# EAGLE design onee_rev1 (EAGLE 7.2.0)
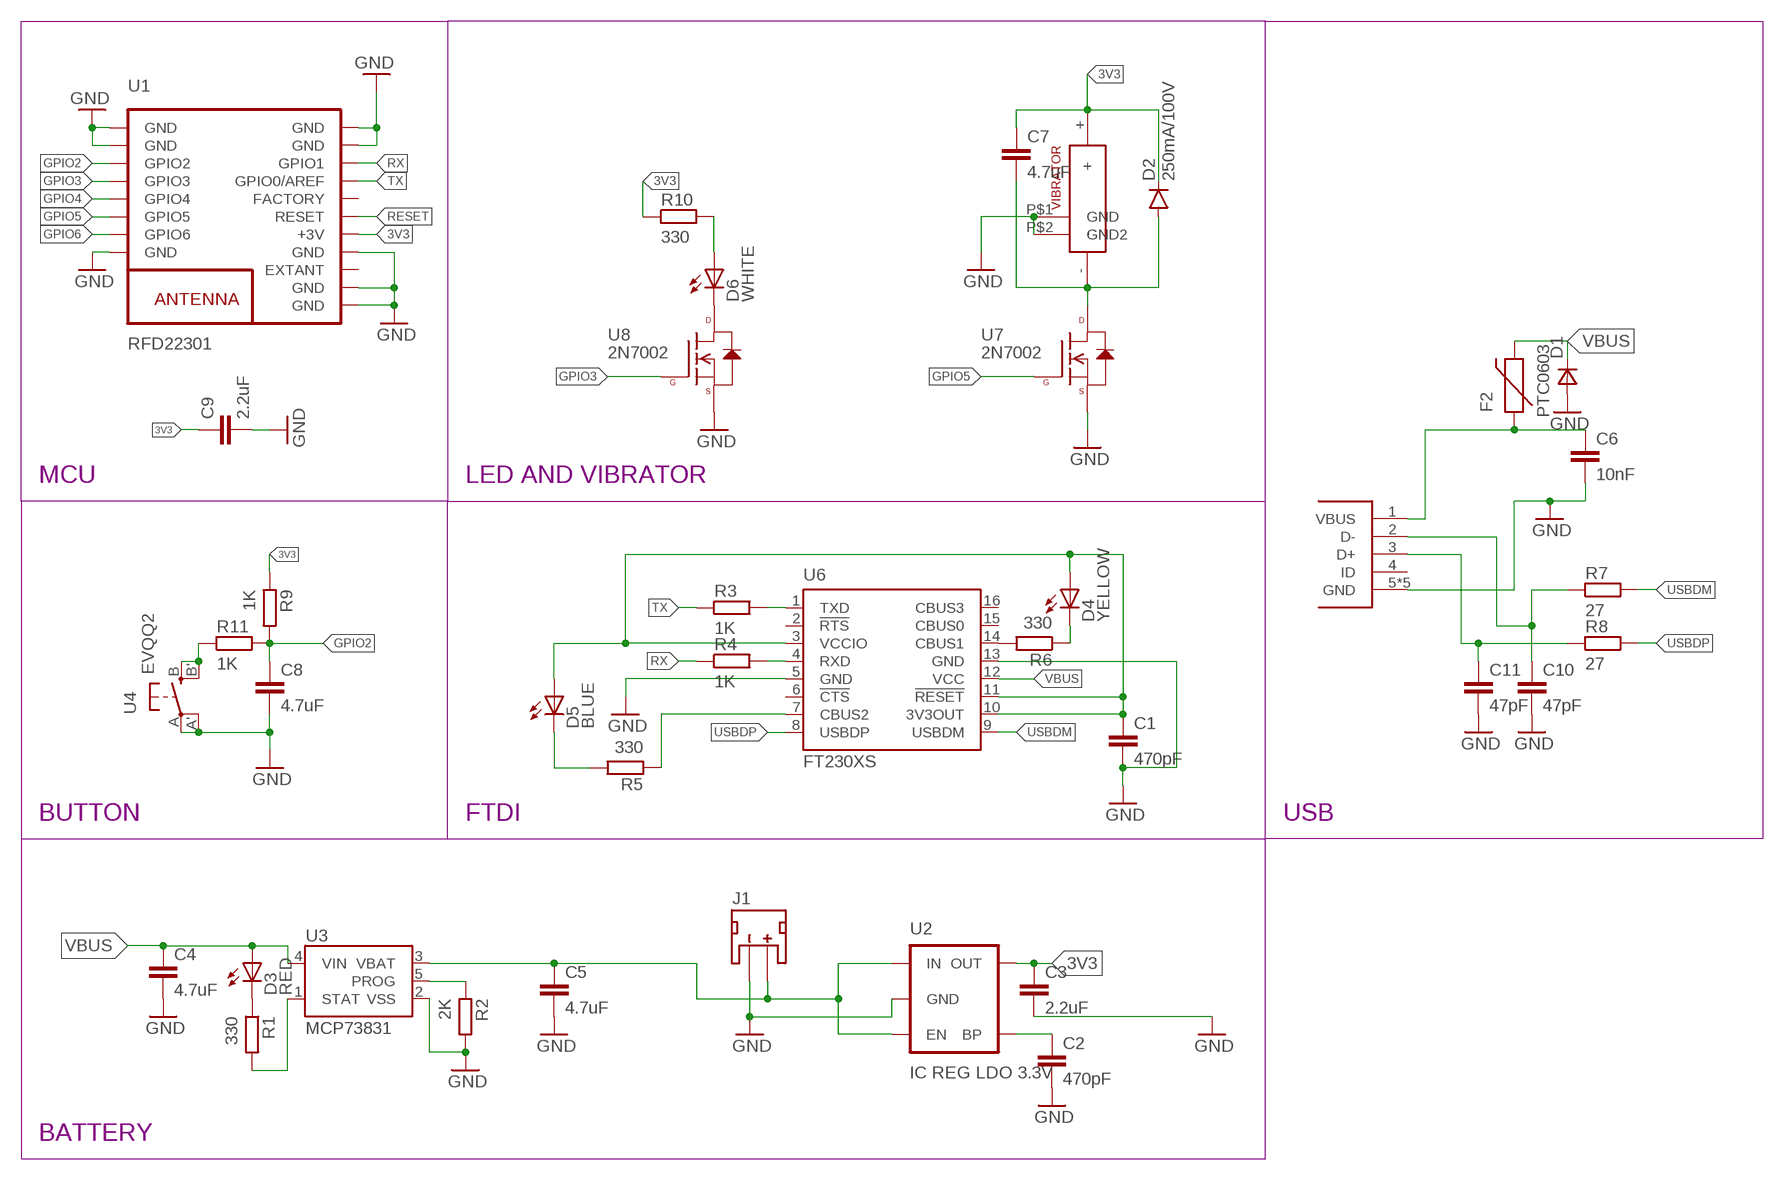
[diagram p0: schematic, sheet 1]

## Parts
C1  470pF  470PF-50V-5%(0603)SMD  [0603-CAP]
C2  470pF  470PF-50V-5%(0603)SMD  [0603-CAP]
C3  2.2uF  2.2UF-10V-20%(0603)  [0603-CAP]
C4  4.7uF  4.7UF-6.3V-10%(0603)0603  [0603-CAP]
C5  4.7uF  4.7UF-6.3V-10%(0603)0603  [0603-CAP]
C6  10nF  10NF/10000PF-50V-10%(0603)  [0603-CAP]
C7  4.7uF  4.7UF-6.3V-10%(0603)0603  [0603-CAP]
C8  4.7uF  4.7UF-6.3V-10%(0603)0603  [0603-CAP]
C9  2.2uF  2.2UF-10V-20%(0603)  [0603-CAP]
C10  47pF  47PF-50V-5%(0603)  [0603-CAP]
C11  47pF  47PF-50V-5%(0603)  [0603-CAP]
D1  DSOD323  [SOD323]
D2  250mA/100V  DIODEBAS16  [SOD-323]
D3  RED  LEDCHIP-LED0805  [CHIP-LED0805]
D4  YELLOW  LEDCHIP-LED0805  [CHIP-LED0805]
D5  BLUE  LEDCHIP-LED0805  [CHIP-LED0805]
D6  WHITE  LED_ESML0603  [LED_SML0603]
F2  PTC0603  [0603]
J1  BATTERY  JST_2MM_MALE  [JST-2-SMD]
R1  330  RESISTOR  [R0603]
R2  2K  RESISTOR  [R0603]
R3  1K  RESISTOR  [R0603]
R4  1K  RESISTOR  [R0603]
R5  330  RESISTOR  [R0603]
R6  330  RESISTOR  [R0603]
R7  27  RESISTOR  [R0603]
R8  27  RESISTOR  [R0603]
R9  1K  RESISTOR  [R0603]
R10  330  RESISTOR  [R0603]
R11  1K  RESISTOR  [R0603]
U1  RFD22301  [RFD22301]
U2  IC REG LDO 3.3V  MIC52053.3V  [SOT23-5]
U3  MCP73831  [SOT23-5]
U4  EVQQ2  [EVQ-Q2]
U5  USB_MICROB  [USB_MICROB]
U6  FT230XS  [SSOP16]
U7  2N7002  N-CHANNEL-MOSFET-BSS138  [SOT23-3]
U8  2N7002  N-CHANNEL-MOSFET-BSS138  [SOT23-3]
U$2  304-100  [304-100]

## Nets
3V3: C3.1 C7.1 C9.1 D2.C R9.1 R10.1 U1.13(+3V) U2.5(OUT) U$2.+
GND: C1.2 C2.2 C3.2 C4.2 C5.2 C6.2 C8.2 C9.2 C10.2 C11.2 D1.2(A) J1.1(-) R2.2 U1.1(GND) U1.2(GND) U1.8(GND) U1.9(GND) U1.10(GND) U1.12(GND) U1.18(GND) U1.19(GND) U2.2(GND) U3.2(VSS) U4.A'(P1) U4.A(P) U5.5(GND) U5.P$6(GND) U5.P$7(GND) U5.P$8(GND) U5.P$9(GND) U6.5(GND) U6.13(GND) U7.2(S) U8.2(S) U$2.P$1(GND) U$2.P$2(GND2)
GPIO2: C8.1 R9.2 R11.2 U1.3(GPIO2)
GPIO3: U1.4(GPIO3) U8.1(G)
GPIO4: U1.5(GPIO4)
GPIO5: U1.6(GPIO5) U7.1(G)
GPIO6: U1.7(GPIO6)
N$1: R3.2 U6.1(TXD)
N$2: C2.1 U2.4(BP)
N$3: R4.2 U6.4(RXD)
N$4: R2.1 U3.5(PROG)
N$5: R6.2 U6.14(CBUS1)
N$6: D5.C R5.2
N$7: C1.1 D4.A D5.A U6.3(VCCIO) U6.10(3V3OUT) U6.11(!RESET)
N$8: D3.C R1.1
N$9: R1.2 U3.1(STAT)
N$10: D4.C R6.1
N$11: R5.1 U6.7(CBUS2)
N$12: D6.C U8.3(D)
N$13: D6.A R10.2
N$14: C10.1 R7.1 U5.2(D-)
N$15: C11.1 R8.1 U5.3(D+)
N$16: C6.1 F2.1 U5.1(VBUS)
N$17: C7.2 D2.A U7.3(D) U$2.-
N$18: R11.1 U4.B'(S1) U4.B(S)
POWER: C5.1 J1.2(+) U2.1(IN) U2.3(EN) U3.3(VBAT)
RESET: U1.14(RESET)
RX: R4.1 U1.17(GPIO1)
TX: R3.1 U1.16(GPIO0/AREF)
USBDM: R7.2 U6.9(USBDM)
USBDP: R8.2 U6.8(USBDP)
VBUS: C4.1 D1.1(C) D3.A F2.2 U3.4(VIN) U6.12(VCC)
Unconnected: J1.NC1(PAD1) J1.NC2(PAD2) U1.11(EXTANT) U1.15(FACTORY) U5.4(ID) U6.2(!RTS) U6.6(!CTS) U6.15(CBUS0) U6.16(CBUS3)

## Notes on the sheet
- MCU | LED AND VIBRATOR
- BUTTON | FTDI | USB
- BATTERY

## Library data of the parts
C1 C2 = SparkFun-Capacitors:470PF-50V-5%(0603): CAP-07884; PROD_ID: CAP-07884
C3 C9 = SparkFun-Capacitors:2.2UF-10V-20%(0603): CAP-07888; PROD_ID: CAP-07888
C4 C5 C7 C8 = SparkFun-Capacitors:4.7UF-6.3V-10%(0603): CAP-08280; PROD_ID: CAP-08280
C6 = SparkFun-Capacitors:10NF/10000PF-50V-10%(0603): CAP-00867; PROD_ID: CAP-00867
C10 C11 = SparkFun-Capacitors:47PF-50V-5%(0603): CAP-08913; PROD_ID: CAP-08913
D1 = zetex:D: DIODE; MPN: CDSOD323-T05C; OC_FARNELL: 1824860; OC_NEWARK: 79R6078
D2 = SparkFun-DiscreteSemi:DIODE: Diode These are standard reverse protection diodes and small signal diodes. SMA package can handle up to about 1A. SOD-323 can handle about 200mA. What the SOD-323 package when ordering, there are some mfgs out there that are 5-pin packages.; PROD_ID: DIO-09646
D3-D5 = adafruit:LED: LED OSRAM: - CHIPLED LG R971, LG N971, LY N971, LG Q971, LY Q971, LO R971, LY R971 LH N974, LH R974 LS Q976, LO Q976, LY Q976 LO Q996 - Hyper CHIPLED LW Q18S LB Q993, LB Q99A, LB R99A - SideLED LS A670, LO A670, LY A670, LG A670, LP A670 LB A673, LV A673, LT A673, LW A673 LH A674 LY A675 LS A676, LA A676, LO A676, LY A676, LW A676 LS A679, LY A679, LG A679 - Hyper Micro SIDELED® LS Y876, LA Y876, LO Y876, LY Y876 LT Y87S - SmartLED LW L88C, LW L88S LB L89C, LB L89S, LG L890 LS L89K, LO L89K, LY L89K LS L896, LA L896, LO L896, LY L896 - TOPLED LS T670, LO T670, LY T670, LG T670, LP T670 LSG T670, LSP T670, LSY T670, LOP T670, LYG T670 LG T671, LOG T671, LSG T671 LB T673, LV T673, LT T673, LW T673 LH T674 LS T676, LA T676, LO T676, LY T676, LB T676, LH T676, LSB T676, LW T676 LB T67C, LV T67C, LT T67C, LS T67K, LO T67K, LY T67K, LW E67C LS E67B, LA E67B, LO E67B, LY E67B, LB E67C, LV E67C, LT E67C LW T67C LS T679, LY T679, LG T679 LS T770, LO T770, LY T770, LG T770, LP T770 LB T773, LV T773, LT T773, LW T773 LH T774 LS E675, LA E675, LY E675, LS T675 LS T776, LA T776, LO T776, LY T776, LB T776 LHGB T686 LT T68C, LB T68C - Hyper Mini TOPLED® LB M676 - Mini TOPLED Santana® LG M470 LS M47K, LO M47K, LY M47K Source: http://www.osram.convergy.de/
D6 = eagle-ltspice:LED_E: LED Source: http://www.osram.convergy.de Source: www.luxeon.com Source: www.kingbright.com; SPICEMODEL: NONE; SPICEPREFIX: D; SPICETYPE: diode
F2 = SparkFun-PowerIC:PTC: Resettable Fuse PTC Resettable Fuse. Spark Fun Electronics SKU : COM-08357
J1 = SparkFun-Connectors:JST_2MM_MALE: Mates to single-cell LiPo batteries. CONN-11443 Now with smashable polarity marks!; BTM_NEG: -; BTM_POS: +; PROD_ID: CONN-11443; TOP_NEG: -; TOP_POS: +
R1-R11 = BaseApp:RESISTOR: Resistance Package :- 0603 Mount :-Surface mount
U1 = RF_Digital_RFD22301_Eagle_Schematic_PCB_Library:RFD22301: RFD22301 RFduino SMT Module RFD22301 Datasheet: http://www.rfdigital.com/wp-content/uploads/2014/03/RFD22301.Data_.Sheet_.11.24.13_11.38PM.pdf
U2 = SparkFun-PowerIC:MIC5205: MIC5205 150mA vreg 3.3V - VREG-00822 5V - VREG-00823; PROD_ID: VREG-00822
U3 = SparkFun-PowerIC:MCP73831: Miniature single cell, fully integrated Li-Ion, Li-polymer charge management controller http://ww1.microchip.com/downloads/en/DeviceDoc/21984a.pdf IC-09995; PROD_ID: IC-09995
U4 = adafruit:EVQQ2: SMT 6mm switch, EVQQ2 series http://www.ladyada.net/library/eagle
U5 = onee:USB_MICROB
U6 = ftdichip:FT230X: USB to BASIC UART IC Auto generated by make-symbol-device-package-bsdl.ulp Rev. 43 Source: Data sheet <http://www.ftdichip.com/Support/Documents/DataSheets/ICs/DS_FT230X.pdf>
U7 U8 = GeekAmmo:N-CHANNEL-MOSFET: N-Channel MOSFET Mode Field Effect Transistor; DATASHEET: http://www.fairchildsemi.com/ds/BS/BSS138.pdf; DIGIKEY: BSS138TR-ND; ELEMENT14: 2323154; URL: http://au.element14.com/fairchild-semiconductor/bss138/mosfet-n-ch-50v-220ma-sot-23/dp/2323154
U$2 = onee:304-100

## Board
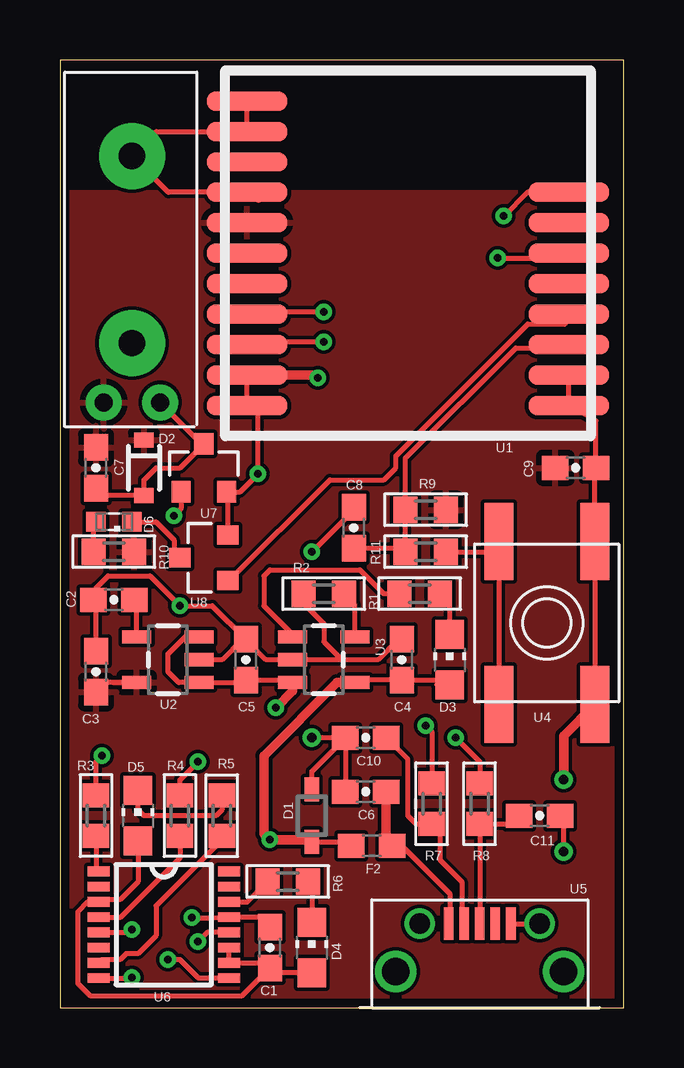
[diagram p1: board, top side]
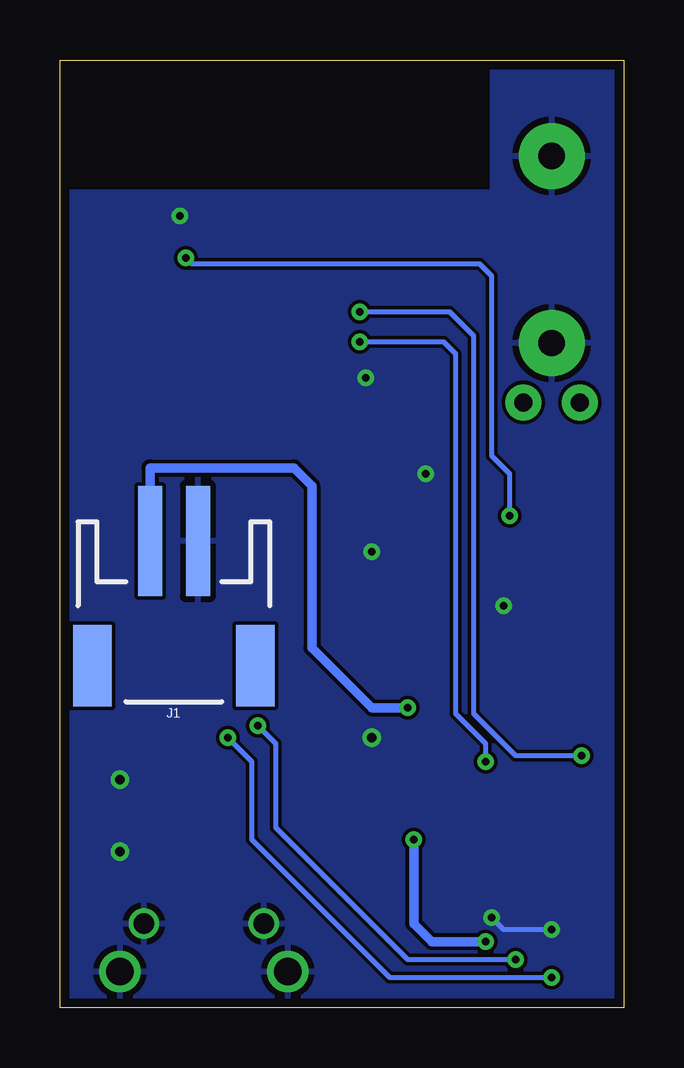
[diagram p2: board, bottom side, seen from below]

Size 23.5 x 39.5 mm. Coordinates in mm from the lower left corner, seen from the top.
Outline: 0,0 23.5,0 23.5,39.5 0,39.5 0,0
Copper layers (1*16): Top 0.0356mm / dielectric 1.5011mm / Bottom 0.0356mm
Design rules "LaenPCBOrder": minimum track width 6mil, minimum drill 13mil, track to track 6mil, track to pad 6mil, pad to pad 6mil, via to via 6mil, smd to smd 6mil, copper to edge 15mil, drill to drill 6mil, minimum pad ring 7mil, minimum via ring 7mil, stop-mask expansion 3mil, vias tented up to drill 0mil, thermal gap 10mil

### Footprints (pad centres in the part's own frame; a part is rotated, then mirrored left to right if it is on the bottom)
0603-CAP = smd 1.1 x 1: 1 -0.85,0; 2 0.85,0
SOD323 = smd 1 x 0.6: 1 -1.1,0; 2 1.1,0
SOD-323 = smd 0.63 x 0.83: A 1.15,0; C -1.15,0
CHIP-LED0805 = smd 1.2 x 1.2: A 0,-1.05; C 0,1.05
LED_SML0603 = smd 0.8 x 0.8: A 0.75,0; C -0.75,0
0603 = smd 1.1 x 1: 1 -0.85,0; 2 0.85,0
JST-2-SMD = smd 1 x 4.6: 1 -1,-3.7; 2 1,-3.7 | smd 1.6 x 3.4: NC1 -3.4,1.5; NC2 3.4,1.5
R0603 = smd 1 x 1.1: 1 -0.85,0; 2 0.85,0
RFD22301 = smd 3.353 x 0.813: 1 -6.706,7.62; 2 -6.706,6.35; 3 -6.706,5.08; 4 -6.706,3.81; 5 -6.706,2.54; 6 -6.706,1.27; 7 -6.706,0; 8 -6.706,-1.27; 9 6.706,-5.08; 10 6.706,-3.81; 11 6.706,-2.54; 12 6.706,-1.27; 13 6.706,0; 14 6.706,1.27; 15 6.706,2.54; 16 6.706,3.81; 17 6.706,5.08; 18 6.706,6.35; 19 6.706,7.62
SOT23-5 = smd 0.55 x 1.2: 1 -0.95,-1.3; 2 0,-1.3; 3 0.95,-1.3; 4 0.95,1.3; 5 -0.95,1.3
EVQ-Q2 = smd 3.2 x 1.2: A -3.4,-2; A' 3.4,-2; B -3.4,2; B' 3.4,2
USB_MICROB = smd 0.4 x 1.35: 1 -1.3,2; 2 -0.65,2; 3 0,2; 4 0.65,2; 5 1.3,2 | drill 0.85 pad 1.25: P$6 2.5,2; P$7 -2.5,2 | drill 1.15 pad 1.55: P$8 -3.5,0; P$9 3.5,0
SSOP16 = smd 0.914 x 0.406: 1 -2.718,2.223; 2 -2.718,1.587; 3 -2.718,0.953; 4 -2.718,0.318; 5 -2.718,-0.318; 6 -2.718,-0.953; 7 -2.718,-1.587; 8 -2.718,-2.223; 9 2.718,-2.223; 10 2.718,-1.587; 11 2.718,-0.953; 12 2.718,-0.318; 13 2.718,0.318; 14 2.718,0.953; 15 2.718,1.587; 16 2.718,2.223
SOT23-3 = smd 0.8 x 0.9: 1 -0.95,-1; 2 0.95,-1; 3 0,1
304-100 = drill 0.75 pad 1.5: + 1.175,10.275; - -1.175,10.275 | drill 1.1 pad 2.75: P$1 0,0; P$2 0,7.8

### Placement (x,y rotation side)
C1  8.75,2.5 90 top
C2  2.25,17 180 top
C3  1.5,14 90 top
C4  14.25,14.5 90 top
C5  7.75,14.5 90 top
C6  12.75,9 180 top
C7  1.5,22.5 270 top
C8  12.25,20 90 top
C9  21.5,22.5 0 top
C10  12.75,11.25 180 top
C11  20,8 0 top
D1  10.5,8 90 top
D2  3.5,22.5 270 top
D3  16.25,14.5 0 top
D4  10.5,2.5 0 top
D5  3.25,8 0 top
D6  2.25,20.25 180 top
F2  13,6.75 180 top
J1  18.75,15.75 180 bottom
R1  15,17.25 180 top
R2  11,17.25 180 top
R3  1.5,8 270 top
R4  5,8 270 top
R5  6.75,8 90 top
R6  9.5,5.25 180 top
R7  15.5,8.5 90 top
R8  17.5,8.5 90 top
R9  15.25,20.75 180 top
R10  2.25,19 180 top
R11  15.25,19 180 top
U1  14.51,32.71 180 top
U2  4.5,14.5 90 top
U3  11,14.5 270 top
U4  20.3,16.03 90 top
U5  17.5,1.5 0 top
U6  4.33,3.45 0 top
U7  6,22.5 0 top
U8  6,18.75 90 top
U$2  3,35.5 180 top

### Tracks (layer width: path | path; a pad name or v marks a point on that pad's centre or on a via)
3V3
  Top 0.2: U2.5 1.9,13.55 C3.1
  pour Top: 0,0 0,34 23.5,34 23.5,0
GND  (via drill 0.33, 0.4)
  Top 0.2: U4.A U4.A' 22.3,22.45 C9.2 22.35,24.46 U1.1 U1.2 | 1.15,15.2 C3.2 1.5,16.65 | 20.57,8 C11.2 21,7.85 v21,6.5 | C10.2 C6.2 | U1.9 U1.10 4.02,36.52 U$2.P$1 4.52,33.98 U1.12 | C10.2 v10.5,11.25 | 1.5,16.65 C2.2 | C5.2 7.6,15.35 6.75,14.5 U2.2 | C5.2 8.6,14.5 U3.2 11.75,14.5 | C4.2 14.1,15.35 13.25,14.5 11.75,14.5 | R2.2 10.15,16.85 11,16 11,15.25 11.75,14.5 | C1.2 8.33,3.77 U6.13 6.28,3.75 v5.5,3.75 | U6.5 2.88,3.13 v3,3.25 | D1.2 10.5,9.85 C10.2 | 1.5,16.65 1.5,17.5 2,18 3.75,18 v5,16.75 6.35,16.75 C5.2 | C8.2 12.25,20.75 v10.5,19 | U8.2 7,21.45 U7.2 7.5,21.5 v8.25,22.25 8.25,24.89 U1.19 U1.18 | U1.8 19.48,33.98 v18.5,33 | U5.5 U5.P$6
  Top 0.4: v21,9.5 21,11.33 U4.A | 8.28,33.75 U1.12 | U1.18 10.64,26.36 v10.75,26.25
  Bottom 0.2: v3,3.25 5,3.25 v5.5,3.75
  pour Bottom: 0,0 0,40 5.5,40 5.5,34 23.5,34 23.5,0
GPIO2
  Top 0.2: C8.1 14.25,19.15 R11.2 R9.2 14.4,22.9 19,27.5 21.34,27.5 U1.3
GPIO3
  Top 0.2: U8.1 7.05,17.8 11.25,22 13.5,22 14,22.5 14,23 19.5,28.5 21.07,28.5 U1.4
GPIO5  (via drill 0.33)
  Top 0.2: U7.1 5.05,20.8 v4.75,20.5 | v18.25,31.25 21.28,31.25 U1.6
  Bottom 0.2: v4.75,20.5 4.75,22.25 5.5,23 5.5,30.5 6,31 18,31 v18.25,31.25
N$1
  Top 0.2: R3.2 1.5,5.79 U6.1
N$2
  Top 0.2: U2.4 3.2,16.65 C2.1
N$3
  Top 0.2: R4.2 5,6.25 2.5,3.75 1.63,3.75 U6.4
N$4
  Top 0.2: U3.5 12.3,16.8 R2.1
N$5
  Top 0.2: U6.14 7.8,4.4 R6.2
N$6
  Top 0.2: R5.2 6.75,8.25 6.5,8 3.5,8 3.25,8.25 D5.C
N$7
  Top 0.2: U6.11 U6.10 8.54,1.86 C1.1 | D4.A 8.95,1.45 C1.1 | C1.1 7.6,0.5 1.25,0.5 0.75,1 0.75,4 1.15,4.4 U6.3 1.71,4.5 2.5,4.5 3.25,5.25 D5.A
N$8
  Top 0.2: D3.C 16.25,16.85 R1.1
N$9
  Top 0.2: U3.1 9.7,15.55 8.5,16.75 8.5,18 8.75,18.25 12.5,18.25 13.5,17.25 R1.2
N$10
  Top 0.2: R6.1 10.5,5.1 D4.C
N$11
  Top 0.2: U6.7 1.75,2 2.5,2 2.75,2.25 3.25,2.25 4,3 4,4.25 6.75,7 R5.1
N$12
  Top 0.2: D6.C 4,20.25 4.75,19.5 4.75,19 U8.3
N$13
  Top 0.2: R10.2 1.4,20.15 D6.A
N$14
  Top 0.2: C10.1 14.5,10.35 14.5,8 14.85,7.65 R7.1 15.85,7.3 15.85,6.15 16.75,5.25 16.75,3.6 U5.2
N$15
  Top 0.2: C11.1 18.8,7.65 R8.1 U5.3
N$16
  Top 0.2: 13.43,7 F2.1 14.25,6.75 16.25,4.75 16.25,3.55 U5.1
  Top 0.4: C6.1 13.6,7 F2.1
N$17
  Top 0.2: C7.2 1.8,21.35 D2.A 3.5,22 4,22.5 5,22.5 U7.3 5.9,23.5 U$2.-
N$18
  Top 0.2: U4.B U4.B' 17.87,19 R11.1
POWER  (via drill 0.33)
  Top 0.2: U2.3 5.75,15.5 5.25,15.5 4.5,14.75 4.5,14 4.95,13.55 U2.1 7.65,13.55 C5.1 9.6,13.65 U3.3
  Top 0.4: U3.3 9.7,13.2 v9,12.5
  Bottom 0.4: v9,12.5 10.5,12.5 13,15 13,21.75 13.75,22.5 19.75,22.5 J1.2
RX  (via drill 0.33)
  Top 0.2: R4.1 5,9.5 v5.75,10.25 | v11,27.75 8.17,27.75 U1.17
  Bottom 0.2: v5.75,10.25 5.75,11 7,12.25 7,27.25 7.5,27.75 v11,27.75
TX  (via drill 0.33)
  Top 0.2: R3.1 1.5,10.25 v1.75,10.5 | v11,29 8.15,29 U1.16
  Bottom 0.2: v1.75,10.5 4.5,10.5 6.25,12.25 6.25,28 7.25,29 v11,29
USBDM  (via drill 0.33)
  Top 0.2: U6.9 5.77,1.23 5,2 v4.5,2 | v15.25,11.75 15.5,11.5 R7.2
  Bottom 0.2: v4.5,2 9,2 14.5,7.5 14.5,11 v15.25,11.75
USBDP  (via drill 0.33)
  Top 0.2: U6.8 2.98,1.23 v3,1.25 | v16.5,11.25 17.5,10.25 R8.2
  Bottom 0.2: v3,1.25 9.75,1.25 15.5,7 15.5,10.25 v16.5,11.25
VBUS  (via drill 0.33)
  Top 0.2: 15.7,13.45 D3.A 16.05,13.65 C4.1 12.4,13.65 U3.4 | D1.1 12,6.9 F2.2 | U6.12 6.13,3.13 v5.75,2.75
  Top 0.4: D1.1 10.4,7 v8.75,7 8.5,7.25 8.5,10.5 11.55,13.55 U3.4
  Bottom 0.4: v5.75,2.75 8,2.75 8.75,3.5 v8.75,7

### Text on the board
tNames: U5